# Altium schematic sheet BLDC_v3.SCHDOC
size 594 x 420 mm; CompanyName: МГТУ СМ-7; SheetNumber: 1; SheetTotal: 1; Scale: 1:1; Title2str: Драйвер BLDC; DocumentType: Схема электрическая принципиальная
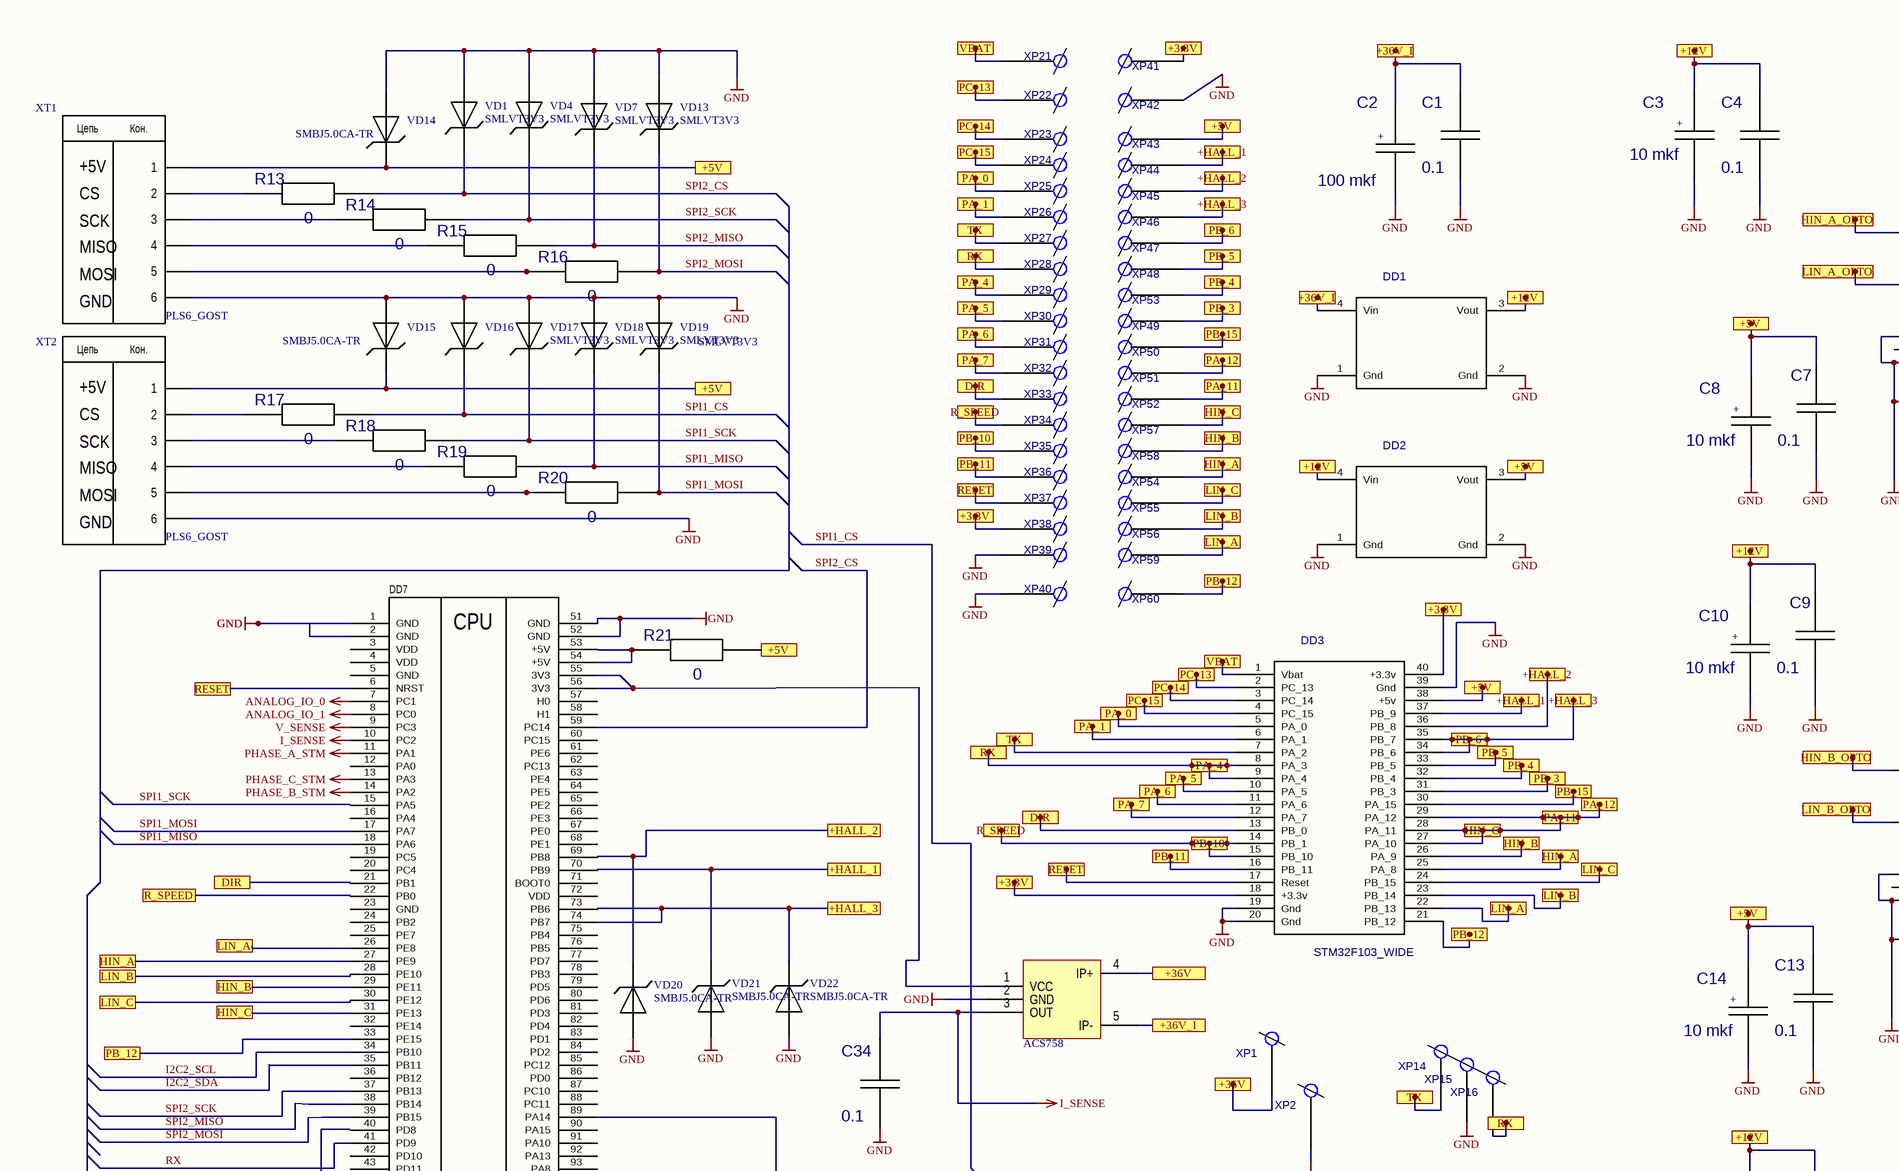
[diagram p0: BLDC_v3.SCHDOC, top left]
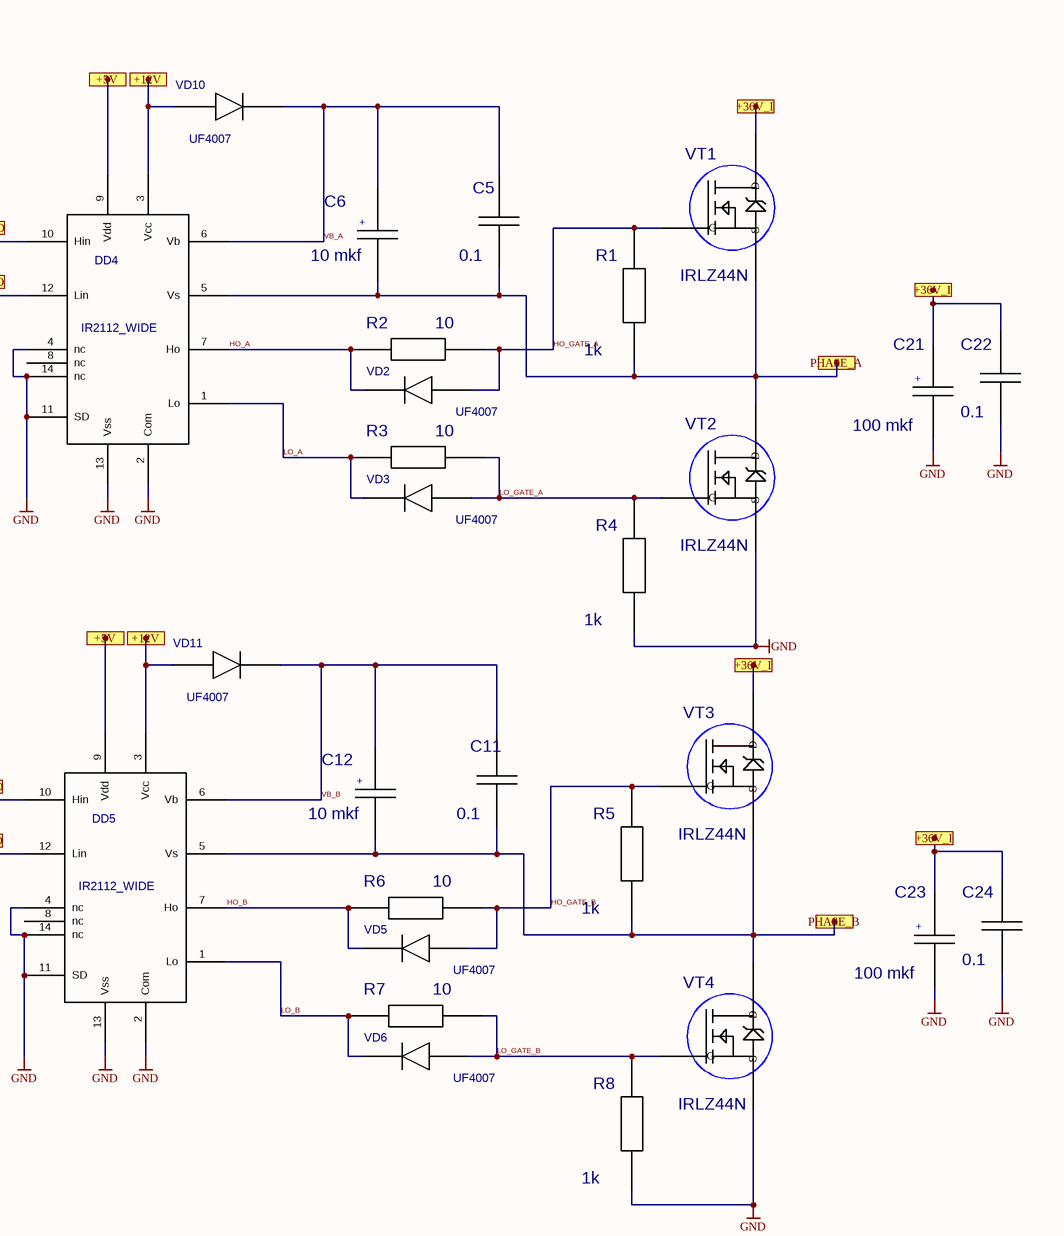
[diagram p1: BLDC_v3.SCHDOC, top right]
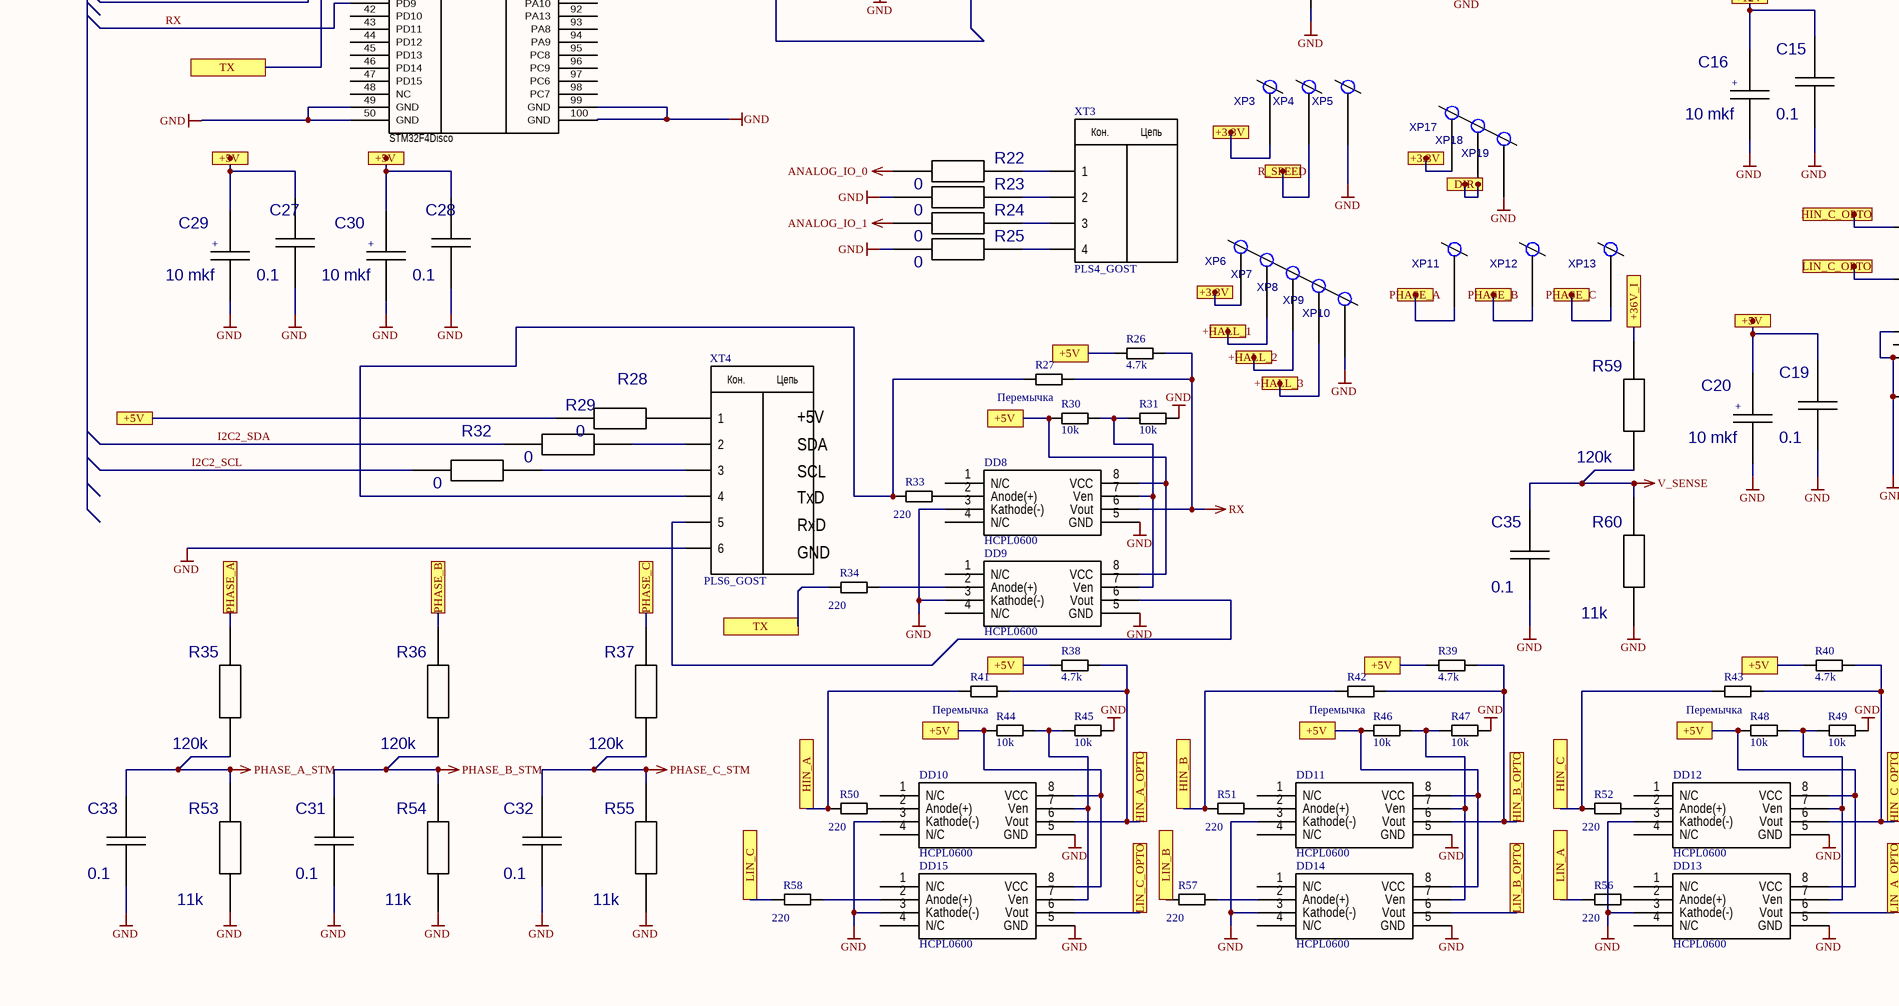
[diagram p2: BLDC_v3.SCHDOC, bottom left]
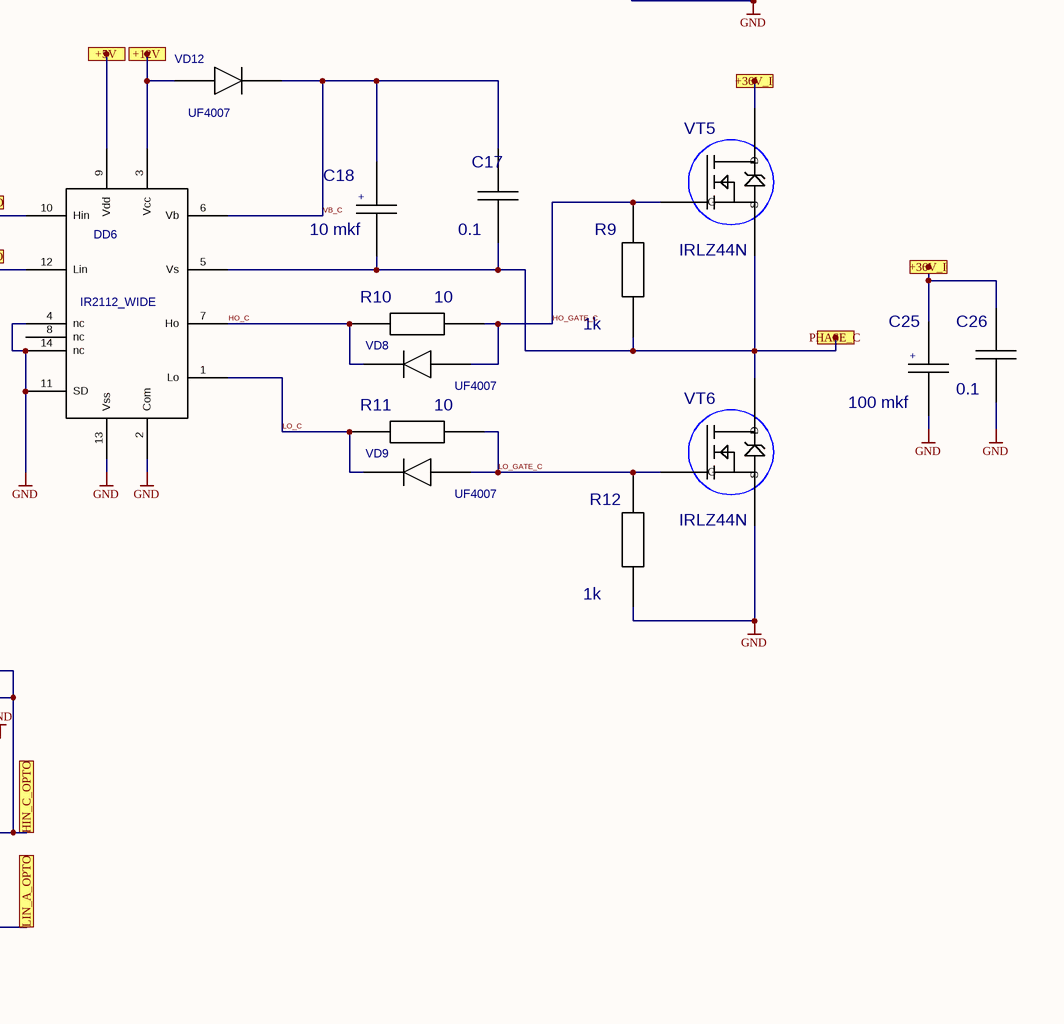
[diagram p3: BLDC_v3.SCHDOC, bottom right]

## Parts
ACS758  ACS758  [ACS_SENSOR]  (value not drawn)
C1  value 0.1  [RC1206]  (hidden comment: C_1206)
C2  value 100 mkf  [C100_WIDE]  (hidden comment: C100_V_WIDE)
C3  value 10 mkf  [C10_V]  (hidden comment: C10_V)
C4  value 0.1  [RC1206]  (hidden comment: C_1206)
C5  value 0.1  [RC1206]  (hidden comment: C_1206)
C6  value 10 mkf  [C10_V]  (hidden comment: C10_V)
C7  value 0.1  [RC1206]  (hidden comment: C_1206)
C8  value 10 mkf  [C10_V]  (hidden comment: C10_V)
C9  value 0.1  [RC1206]  (hidden comment: C_1206)
C10  value 10 mkf  [C10_V]  (hidden comment: C10_V)
C11  value 0.1  [RC1206]  (hidden comment: C_1206)
C12  value 10 mkf  [C10_V]  (hidden comment: C10_V)
C13  value 0.1  [RC1206]  (hidden comment: C_1206)
C14  value 10 mkf  [C10_V]  (hidden comment: C10_V)
C15  value 0.1  [RC1206]  (hidden comment: C_1206)
C16  value 10 mkf  [C10_V]  (hidden comment: C10_V)
C17  value 0.1  [RC1206]  (hidden comment: C_1206)
C18  value 10 mkf  [C10_V]  (hidden comment: C10_V)
C19  value 0.1  [RC1206]  (hidden comment: C_1206)
C20  value 10 mkf  [C10_V]  (hidden comment: C10_V)
C21  value 100 mkf  [C100_WIDE]  (hidden comment: C100_V_WIDE)
C22  value 0.1  [RC1206]  (hidden comment: C_1206)
C23  value 100 mkf  [C100_WIDE]  (hidden comment: C100_V_WIDE)
C24  value 0.1  [RC1206]  (hidden comment: C_1206)
C25  value 100 mkf  [C100_WIDE]  (hidden comment: C100_V_WIDE)
C26  value 0.1  [RC1206]  (hidden comment: C_1206)
C27  value 0.1  [RC1206]  (hidden comment: C_1206)
C28  value 0.1  [RC1206]  (hidden comment: C_1206)
C29  value 10 mkf  [C10_V]  (hidden comment: C10_V)
C30  value 10 mkf  [C10_V]  (hidden comment: C10_V)
C31  value 0.1  [RC1206]  (hidden comment: C_1206)
C32  value 0.1  [RC1206]  (hidden comment: C_1206)
C33  value 0.1  [RC1206]  (hidden comment: C_1206)
C34  value 0.1  [RC1206]  (hidden comment: C_1206)
C35  value 0.1  [RC1206]  (hidden comment: C_1206)
DD1  LM2596_WIDE  [LM2596_WIDE]  (value not drawn)
DD2  LM2596_WIDE  [LM2596_WIDE]  (value not drawn)
DD3  STM32F103_WIDE  [STM32F103_BOARD_WIDE]
DD4  IR2112_WIDE  [DIP14_WIDE_HOLES]
DD5  IR2112_WIDE  [DIP14_WIDE_HOLES]
DD6  IR2112_WIDE  [DIP14_WIDE_HOLES]
DD7  STM32F4Disco  [STM32F407-Disco]
DD8  HCPL0600  [HCPL0600]
DD9  HCPL0600  [HCPL0600]
DD10  HCPL0600  [HCPL0600]
DD11  HCPL0600  [HCPL0600]
DD12  HCPL0600  [HCPL0600]
DD13  HCPL0600  [HCPL0600]
DD14  HCPL0600  [HCPL0600]
DD15  HCPL0600  [HCPL0600]
R1  value 1k  [CC1206]  (hidden comment: R_1206)
R2  value 10  [CC1206]  (hidden comment: R_1206)
R3  value 10  [CC1206]  (hidden comment: R_1206)
R4  value 1k  [CC1206]  (hidden comment: R_1206)
R5  value 1k  [CC1206]  (hidden comment: R_1206)
R6  value 10  [CC1206]  (hidden comment: R_1206)
R7  value 10  [CC1206]  (hidden comment: R_1206)
R8  value 1k  [CC1206]  (hidden comment: R_1206)
R9  value 1k  [CC1206]  (hidden comment: R_1206)
R10  value 10  [CC1206]  (hidden comment: R_1206)
R11  value 10  [CC1206]  (hidden comment: R_1206)
R12  value 1k  [CC1206]  (hidden comment: R_1206)
R13  value 0  [CC1206]  (hidden comment: R_1206)
R14  value 0  [CC1206]  (hidden comment: R_1206)
R15  value 0  [CC1206]  (hidden comment: R_1206)
R16  value 0  [CC1206]  (hidden comment: R_1206)
R17  value 0  [CC1206]  (hidden comment: R_1206)
R18  value 0  [CC1206]  (hidden comment: R_1206)
R19  value 0  [CC1206]  (hidden comment: R_1206)
R20  value 0  [CC1206]  (hidden comment: R_1206)
R21  value 0  [CC1206]  (hidden comment: R_1206)
R22  value 0  [CC1206]  (hidden comment: R_1206)
R23  value 0  [CC1206]  (hidden comment: R_1206)
R24  value 0  [CC1206]  (hidden comment: R_1206)
R25  value 0  [CC1206]  (hidden comment: R_1206)
R26  4.7k  [SMT0603/VISHAY]
R27  Перемычка  [SMT0603/VISHAY]
R28  value 0  [CC1206]  (hidden comment: R_1206)
R29  value 0  [CC1206]  (hidden comment: R_1206)
R30  10k  [SMT0603/VISHAY]
R31  10k  [SMT0603/VISHAY]
R32  value 0  [CC1206]  (hidden comment: R_1206)
R33  220  [SMT0603/VISHAY]
R34  220  [SMT0603/VISHAY]
R35  value 120k  [CC1206]  (hidden comment: R_1206)
R36  value 120k  [CC1206]  (hidden comment: R_1206)
R37  value 120k  [CC1206]  (hidden comment: R_1206)
R38  4.7k  [SMT0603/VISHAY]
R39  4.7k  [SMT0603/VISHAY]
R40  4.7k  [SMT0603/VISHAY]
R41  Перемычка  [SMT0603/VISHAY]
R42  Перемычка  [SMT0603/VISHAY]
R43  Перемычка  [SMT0603/VISHAY]
R44  10k  [SMT0603/VISHAY]
R45  10k  [SMT0603/VISHAY]
R46  10k  [SMT0603/VISHAY]
R47  10k  [SMT0603/VISHAY]
R48  10k  [SMT0603/VISHAY]
R49  10k  [SMT0603/VISHAY]
R50  220  [SMT0603/VISHAY]
R51  220  [SMT0603/VISHAY]
R52  220  [SMT0603/VISHAY]
R53  value 11k  [CC1206]  (hidden comment: R_1206)
R54  value 11k  [CC1206]  (hidden comment: R_1206)
R55  value 11k  [CC1206]  (hidden comment: R_1206)
R56  220  [SMT0603/VISHAY]
R57  220  [SMT0603/VISHAY]
R58  220  [SMT0603/VISHAY]
R59  value 120k  [CC1206]  (hidden comment: R_1206)
R60  value 11k  [CC1206]  (hidden comment: R_1206)
VD1  SMLVT3V3  [DO214AA SMB]
VD2  value UF4007  [DIODE_V_WIDE_HOLES]  (hidden comment: DIODE_LIE_WIDE)
VD3  value UF4007  [DIODE_V_WIDE_HOLES]  (hidden comment: DIODE_LIE_WIDE)
VD4  SMLVT3V3  [DO214AA SMB]
VD5  value UF4007  [DIODE_V_WIDE_HOLES]  (hidden comment: DIODE_LIE_WIDE)
VD6  value UF4007  [DIODE_V_WIDE_HOLES]  (hidden comment: DIODE_LIE_WIDE)
VD7  SMLVT3V3  [DO214AA SMB]
VD8  value UF4007  [DIODE_V_WIDE_HOLES]  (hidden comment: DIODE_LIE_WIDE)
VD9  value UF4007  [DIODE_V_WIDE_HOLES]  (hidden comment: DIODE_LIE_WIDE)
VD10  value UF4007  [DIODE_V_WIDE_HOLES]  (hidden comment: DIODE_LIE_WIDE)
VD11  value UF4007  [DIODE_V_WIDE_HOLES]  (hidden comment: DIODE_LIE_WIDE)
VD12  value UF4007  [DIODE_V_WIDE_HOLES]  (hidden comment: DIODE_LIE_WIDE)
VD13  SMLVT3V3  [DO214AA SMB]
VD14  SMBJ5.0CA-TR  [DO214AA SMB]
VD15  SMBJ5.0CA-TR  [DO214AA SMB]
VD16  SMLVT3V3  [DO214AA SMB]
VD17  SMLVT3V3  [DO214AA SMB]
VD18  SMLVT3V3  [DO214AA SMB]
VD19  SMLVT3V3  [DO214AA SMB]
VD20  SMBJ5.0CA-TR  [DO214AA SMB]
VD21  SMBJ5.0CA-TR  [DO214AA SMB]
VD22  SMBJ5.0CA-TR  [DO214AA SMB]
VT1  IRLZ44N  [IRLZ44N]
VT2  IRLZ44N  [IRLZ44N]
VT3  IRLZ44N  [IRLZ44N]
VT4  IRLZ44N  [IRLZ44N]
VT5  IRLZ44N  [IRLZ44N]
VT6  IRLZ44N  [IRLZ44N]
XP1  XP_1_WIDE  [XP_WIDE]  (value not drawn)
XP2  XP_1_WIDE  [XP_WIDE]  (value not drawn)
XP3  XP_1_WIDE  [XP_WIDE]  (value not drawn)
XP4  XP_1_WIDE  [XP_WIDE]  (value not drawn)
XP5  XP_1_WIDE  [XP_WIDE]  (value not drawn)
XP6  XP_1_WIDE  [XP_WIDE]  (value not drawn)
XP7  XP_1_WIDE  [XP_WIDE]  (value not drawn)
XP8  XP_1_WIDE  [XP_WIDE]  (value not drawn)
XP9  XP_1_WIDE  [XP_WIDE]  (value not drawn)
XP10  XP_1_WIDE  [XP_WIDE]  (value not drawn)
XP11  XP_1_WIDE  [XP_WIDE]  (value not drawn)
XP12  XP_1_WIDE  [XP_WIDE]  (value not drawn)
XP13  XP_1_WIDE  [XP_WIDE]  (value not drawn)
XP14  XP_1_WIDE  [XP_WIDE]  (value not drawn)
XP15  XP_1_WIDE  [XP_WIDE]  (value not drawn)
XP16  XP_1_WIDE  [XP_WIDE]  (value not drawn)
XP17  XP_1_WIDE  [XP_WIDE]  (value not drawn)
XP18  XP_1_WIDE  [XP_WIDE]  (value not drawn)
XP19  XP_1_WIDE  [XP_WIDE]  (value not drawn)
XP21  XP_1_WIDE  [XP_WIDE]  (value not drawn)
XP22  XP_1_WIDE  [XP_WIDE]  (value not drawn)
XP23  XP_1_WIDE  [XP_WIDE]  (value not drawn)
XP24  XP_1_WIDE  [XP_WIDE]  (value not drawn)
XP25  XP_1_WIDE  [XP_WIDE]  (value not drawn)
XP26  XP_1_WIDE  [XP_WIDE]  (value not drawn)
XP27  XP_1_WIDE  [XP_WIDE]  (value not drawn)
XP28  XP_1_WIDE  [XP_WIDE]  (value not drawn)
XP29  XP_1_WIDE  [XP_WIDE]  (value not drawn)
XP30  XP_1_WIDE  [XP_WIDE]  (value not drawn)
XP31  XP_1_WIDE  [XP_WIDE]  (value not drawn)
XP32  XP_1_WIDE  [XP_WIDE]  (value not drawn)
XP33  XP_1_WIDE  [XP_WIDE]  (value not drawn)
XP34  XP_1_WIDE  [XP_WIDE]  (value not drawn)
XP35  XP_1_WIDE  [XP_WIDE]  (value not drawn)
XP36  XP_1_WIDE  [XP_WIDE]  (value not drawn)
XP37  XP_1_WIDE  [XP_WIDE]  (value not drawn)
XP38  XP_1_WIDE  [XP_WIDE]  (value not drawn)
XP39  XP_1_WIDE  [XP_WIDE]  (value not drawn)
XP40  XP_1_WIDE  [XP_WIDE]  (value not drawn)
XP41  XP_1_WIDE  [XP_WIDE]  (value not drawn)
XP42  XP_1_WIDE  [XP_WIDE]  (value not drawn)
XP43  XP_1_WIDE  [XP_WIDE]  (value not drawn)
XP44  XP_1_WIDE  [XP_WIDE]  (value not drawn)
XP45  XP_1_WIDE  [XP_WIDE]  (value not drawn)
XP46  XP_1_WIDE  [XP_WIDE]  (value not drawn)
XP47  XP_1_WIDE  [XP_WIDE]  (value not drawn)
XP48  XP_1_WIDE  [XP_WIDE]  (value not drawn)
XP49  XP_1_WIDE  [XP_WIDE]  (value not drawn)
XP50  XP_1_WIDE  [XP_WIDE]  (value not drawn)
XP51  XP_1_WIDE  [XP_WIDE]  (value not drawn)
XP52  XP_1_WIDE  [XP_WIDE]  (value not drawn)
XP53  XP_1_WIDE  [XP_WIDE]  (value not drawn)
XP54  XP_1_WIDE  [XP_WIDE]  (value not drawn)
XP55  XP_1_WIDE  [XP_WIDE]  (value not drawn)
XP56  XP_1_WIDE  [XP_WIDE]  (value not drawn)
XP57  XP_1_WIDE  [XP_WIDE]  (value not drawn)
XP58  XP_1_WIDE  [XP_WIDE]  (value not drawn)
XP59  XP_1_WIDE  [XP_WIDE]  (value not drawn)
XP60  XP_1_WIDE  [XP_WIDE]  (value not drawn)
XT1  PLS6_GOST  [XP_6_PIN]
XT2  PLS6_GOST  [XP_6_PIN]
XT3  PLS4_GOST  [XP_4_PIN_2]
XT4  PLS6_GOST  [XP_6_PIN]

## Ports
+3.3V, +5V, +12V, +36V, +36V_I, +HALL_1, +HALL_2, +HALL_3, DIR, HIN_A, HIN_A_OPTO, HIN_B, HIN_B_OPTO, HIN_C, HIN_C_OPTO, LIN_A, LIN_A_OPTO, LIN_B, LIN_B_OPTO, LIN_C, LIN_C_OPTO, PA_0, PA_1, PA_4, PA_5, PA_6, PA_7, PA_11, PA_12, PB_3, PB_4, PB_5, PB_6, PB_10, PB_11, PB_12, PB_15, PC_13, PC_14, PC_15, PHASE_A, PHASE_B, PHASE_C, R_SPEED, RESET, RX, TX, VBAT

## Nets
ANALOG_IO_0: DD7.7(PC1) R22.2(A2)
ANALOG_IO_1: DD7.8(PC0) R24.2(A2)
GND: ACS758.2(GND) C1.1(A1) C2.2(A1) C3.2(A1) C4.1(A1) C7.1(A1) C8.2(A1) C9.1(A1) C10.2(A1) C13.1(A1) C14.2(A1) C15.1(A1) C16.2(A1) C19.1(A1) C20.2(A1) C21.2(A1) C22.1(A1) C23.2(A1) C24.1(A1) C25.2(A1) C26.1(A1) C27.1(A1) C28.1(A1) C29.2(A1) C30.2(A1) C31.1(A1) C32.1(A1) C33.1(A1) C34.1(A1) C35.1(A1) DD1.1(Gnd) DD1.2(Gnd) DD2.1(Gnd) DD2.2(Gnd) DD3.19(Gnd) DD3.20(Gnd) DD3.39(Gnd) DD4.2(Com) DD4.4(nc) DD4.11(SD) DD4.13(Vss) DD4.14(nc) DD5.2(Com) DD5.4(nc) DD5.11(SD) DD5.13(Vss) DD5.14(nc) DD6.2(Com) DD6.4(nc) DD6.11(SD) DD6.13(Vss) DD6.14(nc) DD7.1(GND) DD7.2(GND) DD7.49(GND) DD7.50(GND) DD7.51(GND) DD7.52(GND) DD7.99(GND) DD7.100(GND) DD8.3(Kathode(-)) DD8.5(GND) DD9.3(Kathode(-)) DD9.5(GND) DD10.3(Kathode(-)) DD10.5(GND) DD11.3(Kathode(-)) DD11.5(GND) DD12.3(Kathode(-)) DD12.5(GND) DD13.3(Kathode(-)) DD13.5(GND) DD14.3(Kathode(-)) DD14.5(GND) DD15.3(Kathode(-)) DD15.5(GND) R4.2(A2) R8.2(A2) R12.2(A2) R23.2(A2) R25.2(A2) R31.2 R45.2 R47.2 R49.2 R53.2(A2) R54.2(A2) R55.2(A2) R60.2(A2) VD1.1 VD4.1 VD7.1 VD13.1 VD14.1 VD15.1 VD16.1 VD17.1 VD18.1 VD19.1 VD20.1 VD21.1 VD22.1 VT2.3(S) VT4.3(S) VT6.3(S) XP2.1 XP5.1 XP10.1 XP15.1 XP19.1 XP39.1 XP40.1 XP42.1 XT1.6 XT2.6 XT4.6
I_SENSE: ACS758.3(OUT) C34.2(A2) DD7.10(PC2)
PHASE_A_STM: C33.2(A2) DD7.11(PA1) R35.2(A2) R53.1(A1)
PHASE_B_STM: C31.2(A2) DD7.14(PA2) R36.2(A2) R54.1(A1)
PHASE_C_STM: C32.2(A2) DD7.13(PA3) R37.2(A2) R55.1(A1)
RX: DD7.41(PD9) DD8.6(Vout) R26.2 R27.2
V_SENSE: C35.2(A2) DD7.9(PC3) R59.2(A2) R60.1(A1)
+5V: DD8.8(VCC) DD9.8(VCC) DD10.8(VCC) DD11.8(VCC) DD12.8(VCC) DD13.8(VCC) DD14.8(VCC) DD15.8(VCC) R21.2(A2) R26.1 R28.2(A2) R30.1 R38.1 R39.1 R40.1 R44.1 R46.1 R48.1 VD14.2 VD15.2 XT1.1 XT2.1 ; port +5V
+36V: ACS758.4(IP+) ; port +36V
+36V_I: ACS758.5(IP-) R59.1(A1) ; port +36V_I
+HALL_1: DD7.70(PB9) VD21.2 ; port +HALL_1
+HALL_2: DD7.69(PB8) VD20.2 ; port +HALL_2
+HALL_3: DD7.73(PB6) DD7.74(PB7) VD22.2 ; port +HALL_3
DIR: DD7.21(PB1) ; port DIR
HIN_A: DD7.27(PE9) R41.1 R50.1 ; port HIN_A
HIN_A_OPTO: DD10.6(Vout) R38.2 R41.2 ; port HIN_A_OPTO
HIN_B: DD7.29(PE11) R42.1 R51.1 ; port HIN_B
HIN_B_OPTO: DD11.6(Vout) R39.2 R42.2 ; port HIN_B_OPTO
HIN_C: DD3.27(PA_10) DD3.28(PA_11) DD3.29(PA_12) DD7.31(PE13) R43.1 R52.1 ; port HIN_C, port PA_11
HIN_C_OPTO: DD12.6(Vout) R40.2 R43.2 ; port HIN_C_OPTO
HO_A: DD4.7(Ho) R2.1(A1) VD2.2(A)
HO_B: DD5.7(Ho) R6.1(A1) VD5.2(A)
HO_C: DD6.7(Ho) R10.1(A1) VD8.2(A)
HO_GATE_A: R1.1(A1) R2.2(A2) VD2.1(C) VT1.1(G)
HO_GATE_B: R5.1(A1) R6.2(A2) VD5.1(C) VT3.1(G)
HO_GATE_C: R9.1(A1) R10.2(A2) VD8.1(C) VT5.1(G)
I2C2_SCL: DD7.34(PB10) R32.2(A2)
I2C2_SDA: DD7.35(PB11) R29.2(A2)
LIN_A: DD7.26(PE8) R56.1 ; port LIN_A
LIN_A_OPTO: DD13.6(Vout) ; port LIN_A_OPTO
LIN_B: DD7.28(PE10) R57.1 ; port LIN_B
LIN_B_OPTO: DD14.6(Vout) ; port LIN_B_OPTO
LIN_C: DD7.30(PE12) R58.1 ; port LIN_C
LIN_C_OPTO: DD15.6(Vout) ; port LIN_C_OPTO
LO_A: DD4.1(Lo) R3.1(A1) VD3.2(A)
LO_B: DD5.1(Lo) R7.1(A1) VD6.2(A)
LO_C: DD6.1(Lo) R11.1(A1) VD9.2(A)
LO_GATE_A: R3.2(A2) R4.1(A1) VD3.1(C) VT2.1(G)
LO_GATE_B: R7.2(A2) R8.1(A1) VD6.1(C) VT4.1(G)
LO_GATE_C: R11.2(A2) R12.1(A1) VD9.1(C) VT6.1(G)
PA_4: DD3.8(PA_3) DD3.9(PA_4) ; port PA_4
PB_6: DD3.34(PB_6) DD3.35(PB_7) ; port PB_6
PB_10: DD3.14(PB_1) DD3.15(PB_10) ; port PB_10
PB_12: DD7.33(PE15) ; port PB_12
PHASE_A: R35.1(A1) ; port PHASE_A
PHASE_B: R36.1(A1) ; port PHASE_B
PHASE_C: R37.1(A1) ; port PHASE_C
R_SPEED: DD7.22(PB0) ; port R_SPEED
RESET: DD7.6(NRST) ; port RESET
SPI1_CS: DD7.89(PA14) R17.2(A2) VD16.2
SPI1_MISO: DD7.18(PA6) R19.2(A2) VD18.2
SPI1_MOSI: DD7.17(PA7) R20.2(A2) VD19.2
SPI1_SCK: DD7.15(PA5) R18.2(A2) VD17.2
SPI2_CS: DD7.59(PC14) R13.2(A2) VD1.2
SPI2_MISO: DD7.38(PB14) R15.2(A2) VD7.2
SPI2_MOSI: DD7.39(PB15) R16.2(A2) VD13.2
SPI2_SCK: DD7.37(PB13) R14.2(A2) VD4.2
TX: DD7.40(PD8) R34.1 ; port TX
VB_A: C5.2(A2) C6.1(A2) DD4.6(Vb) VD10.2(A)
VB_B: C11.2(A2) C12.1(A2) DD5.6(Vb) VD11.2(A)
VB_C: C17.2(A2) C18.1(A2) DD6.6(Vb) VD12.2(A)
NetACS758_1: ACS758.1(VCC) DD7.55(3V3) DD7.56(3V3)
NetC1_2: C1.2(A2) C2.1(A2)
NetC3_1: C3.1(A2) C4.2(A2)
NetC5_1: C5.1(A1) C6.2(A1) DD4.5(Vs) R1.2(A2) VT1.3(S) VT2.2(D)
NetC7_2: C7.2(A2) C8.1(A2)
NetC9_2: C9.2(A2) C10.1(A2)
NetC11_1: C11.1(A1) C12.2(A1) DD5.5(Vs) R5.2(A2) VT3.3(S) VT4.2(D)
NetC13_2: C13.2(A2) C14.1(A2)
NetC15_2: C15.2(A2) C16.1(A2)
NetC17_1: C17.1(A1) C18.2(A1) DD6.5(Vs) R9.2(A2) VT5.3(S) VT6.2(D)
NetC19_2: C19.2(A2) C20.1(A2)
NetC21_1: C21.1(A2) C22.2(A2)
NetC23_1: C23.1(A2) C24.2(A2)
NetC25_1: C25.1(A2) C26.2(A2)
NetC27_2: C27.2(A2) C29.1(A2)
NetC28_2: C28.2(A2) C30.1(A2)
NetDD4_3: DD4.3(Vcc) VD10.1(C)
NetDD5_3: DD5.3(Vcc) VD11.1(C)
NetDD6_3: DD6.3(Vcc) VD12.1(C)
NetDD7_53: DD7.53(+5V) DD7.54(+5V) R21.1(A1)
NetDD8_2: DD8.2(Anode(+)) R33.2
NetDD8_7: DD8.7(Ven) DD9.7(Ven) R30.2 R31.1
NetDD9_2: DD9.2(Anode(+)) R34.2
NetDD9_6: DD9.6(Vout) XT4.5
NetDD10_2: DD10.2(Anode(+)) R50.2
NetDD10_7: DD10.7(Ven) DD15.7(Ven) R44.2 R45.1
NetDD11_2: DD11.2(Anode(+)) R51.2
NetDD11_7: DD11.7(Ven) DD14.7(Ven) R46.2 R47.1
NetDD12_2: DD12.2(Anode(+)) R52.2
NetDD12_7: DD12.7(Ven) DD13.7(Ven) R48.2 R49.1
NetDD13_2: DD13.2(Anode(+)) R56.2
NetDD14_2: DD14.2(Anode(+)) R57.2
NetDD15_2: DD15.2(Anode(+)) R58.2
NetR13_1: R13.1(A1) XT1.2
NetR14_1: R14.1(A1) XT1.3
NetR15_1: R15.1(A1) XT1.4
NetR16_1: R16.1(A1) XT1.5
NetR17_1: R17.1(A1) XT2.2
NetR18_1: R18.1(A1) XT2.3
NetR19_1: R19.1(A1) XT2.4
NetR20_1: R20.1(A1) XT2.5
NetR22_1: R22.1(A1) XT3.1
NetR23_1: R23.1(A1) XT3.2
NetR24_1: R24.1(A1) XT3.3
NetR25_1: R25.1(A1) XT3.4
NetR27_1: R27.1 R33.1 XT4.4
NetR28_1: R28.1(A1) XT4.1
NetR29_1: R29.1(A1) XT4.2
NetR32_1: R32.1(A1) XT4.3

Not connected (* = marked no-connect by the designer): DD1 3(Vout) 4(Vin); DD2 3(Vout) 4(Vin); DD3 1(Vbat) 2(PC_13) 3(PC_14) 4(PC_15) 5(PA_0) 6(PA_1) 7(PA_2) 10(PA_5) 11(PA_6) 12(PA_7) 13(PB_0) 16(PB_11) 17(Reset) 18(+3.3v) 21(PB_12) 22(PB_13) 23(PB_14) 24(PB_15) 25(PA_8) 26(PA_9) 30(PA_15) 31(PB_3) 32(PB_4) 33(PB_5) 36(PB_8) 37(PB_9) 38(+5v) 40(+3.3v); DD4 8(nc) 9(Vdd) 10(Hin) 12(Lin); DD5 8(nc) 9(Vdd) 10(Hin) 12(Lin); DD6 8(nc) 9(Vdd) 10(Hin) 12(Lin); DD7 3(VDD) 4(VDD) 5(GND) 12(PA0) 16(PA4) 19(PC5) 20(PC4) 23(GND) 24(PB2) 25(PE7) 32(PE14) 36(PB12) 42(PD10) 43(PD11) 44(PD12) 45(PD13) 46(PD14) 47(PD15) 48(NC) 57(H0) 58(H1) 60(PC15) 61(PE6) 62(PC13) 63(PE4) 64(PE5) 65(PE2) 66(PE3) 67(PE0) 68(PE1) 71(BOOT0) 72(VDD) 75(PB4) 76(PB5) 77(PD7) 78(PB3) 79(PD5) 80(PD6) 81(PD3) 82(PD4) 83(PD1) 84(PD2) 85(PC12) 86(PD0) 87(PC10) 88(PC11) 90(PA15) 91(PA10) 92(PA13) 93(PA8) 94(PA9) 95(PC8) 96(PC9) 97(PC6) 98(PC7); DD8 1(N/C) 4(N/C); DD9 1(N/C) 4(N/C); DD10 1(N/C) 4(N/C); DD11 1(N/C) 4(N/C); DD12 1(N/C) 4(N/C); DD13 1(N/C) 4(N/C); DD14 1(N/C) 4(N/C); DD15 1(N/C) 4(N/C); VT1 2(D); VT3 2(D); VT5 2(D); XP1 1; XP3 1; XP4 1; XP6 1; XP7 1; XP8 1; XP9 1; XP11 1; XP12 1; XP13 1; XP14 1; XP16 1; XP17 1; XP18 1; XP21 1; XP22 1; XP23 1; XP24 1; XP25 1; XP26 1; XP27 1; XP28 1; XP29 1; XP30 1; XP31 1; XP32 1; XP33 1; XP34 1; XP35 1; XP36 1; XP37 1; XP38 1; XP41 1; XP43 1; XP44 1; XP45 1; XP46 1; XP47 1; XP48 1; XP49 1; XP50 1; XP51 1; XP52 1; XP53 1; XP54 1; XP55 1; XP56 1; XP57 1; XP58 1; XP59 1; XP60 1

## Notes on the sheet
- CS
- +5V
- SCK
- (near XT1) MISO
- (near XT1) MOSI
- GND
- (near XT2) MISO
- (near XT2) MOSI
- SDA
- SCL
- TxD
- RxD
- Перв. примен.
- Справ. №
- Подп. и дата
- Инв. № дубл.
- Взам. инв. №
- Разраб.
- Изм.
- Лист
- № докум.
- Подп.
- Дата
- Лит.
- Масса
- Масштаб
- Пров.
- Т.контр.
- Листов
- Инв. № подл.
- Утв.
- Н.контр.
- 2.106-A2
- Копировал
- Формат А2
- (in symbol C10_V) +
- (in symbol C100_V_WIDE) +
- (in symbol PLS4_GOST) Кон.; Цепь
- (in symbol PLS6_GOST) Цепь; Кон.
- (in symbol STM32F4Disco) CPU

## Library data of the parts
R26 R27 R33 R34 R38-R43 R50-R52 R56-R58 = CRCW060310K0FKEA/MURATA: 10k
R30 R31 R44-R49 = CRCW060310K0FKEA/MURATA
XT1 XT2 XT4 = PLS6_GOST: Header, 6-Pin; LatestRevisionDate: 17-Jul-2002; LatestRevisionNote: Re-released for DXP Platform.; Publisher: Altium Limited
XT3 = PLS4_GOST: Header, 5-Pin; LatestRevisionDate: 17-Jul-2002; LatestRevisionNote: Re-released for DXP Platform.; Publisher: Altium Limited
DD1 DD2 = LM2596_WIDE: Value: *
DD3 = STM32F103_WIDE: Value: *
DD4-DD6 = IR2112_WIDE: Value: *
VT1-VT6 = IRLZ44N: Value: *
XP1-XP19 XP21-XP60 = XP_1_WIDE: Value: *